# Altium schematic sheet 33.SchDoc
size A2
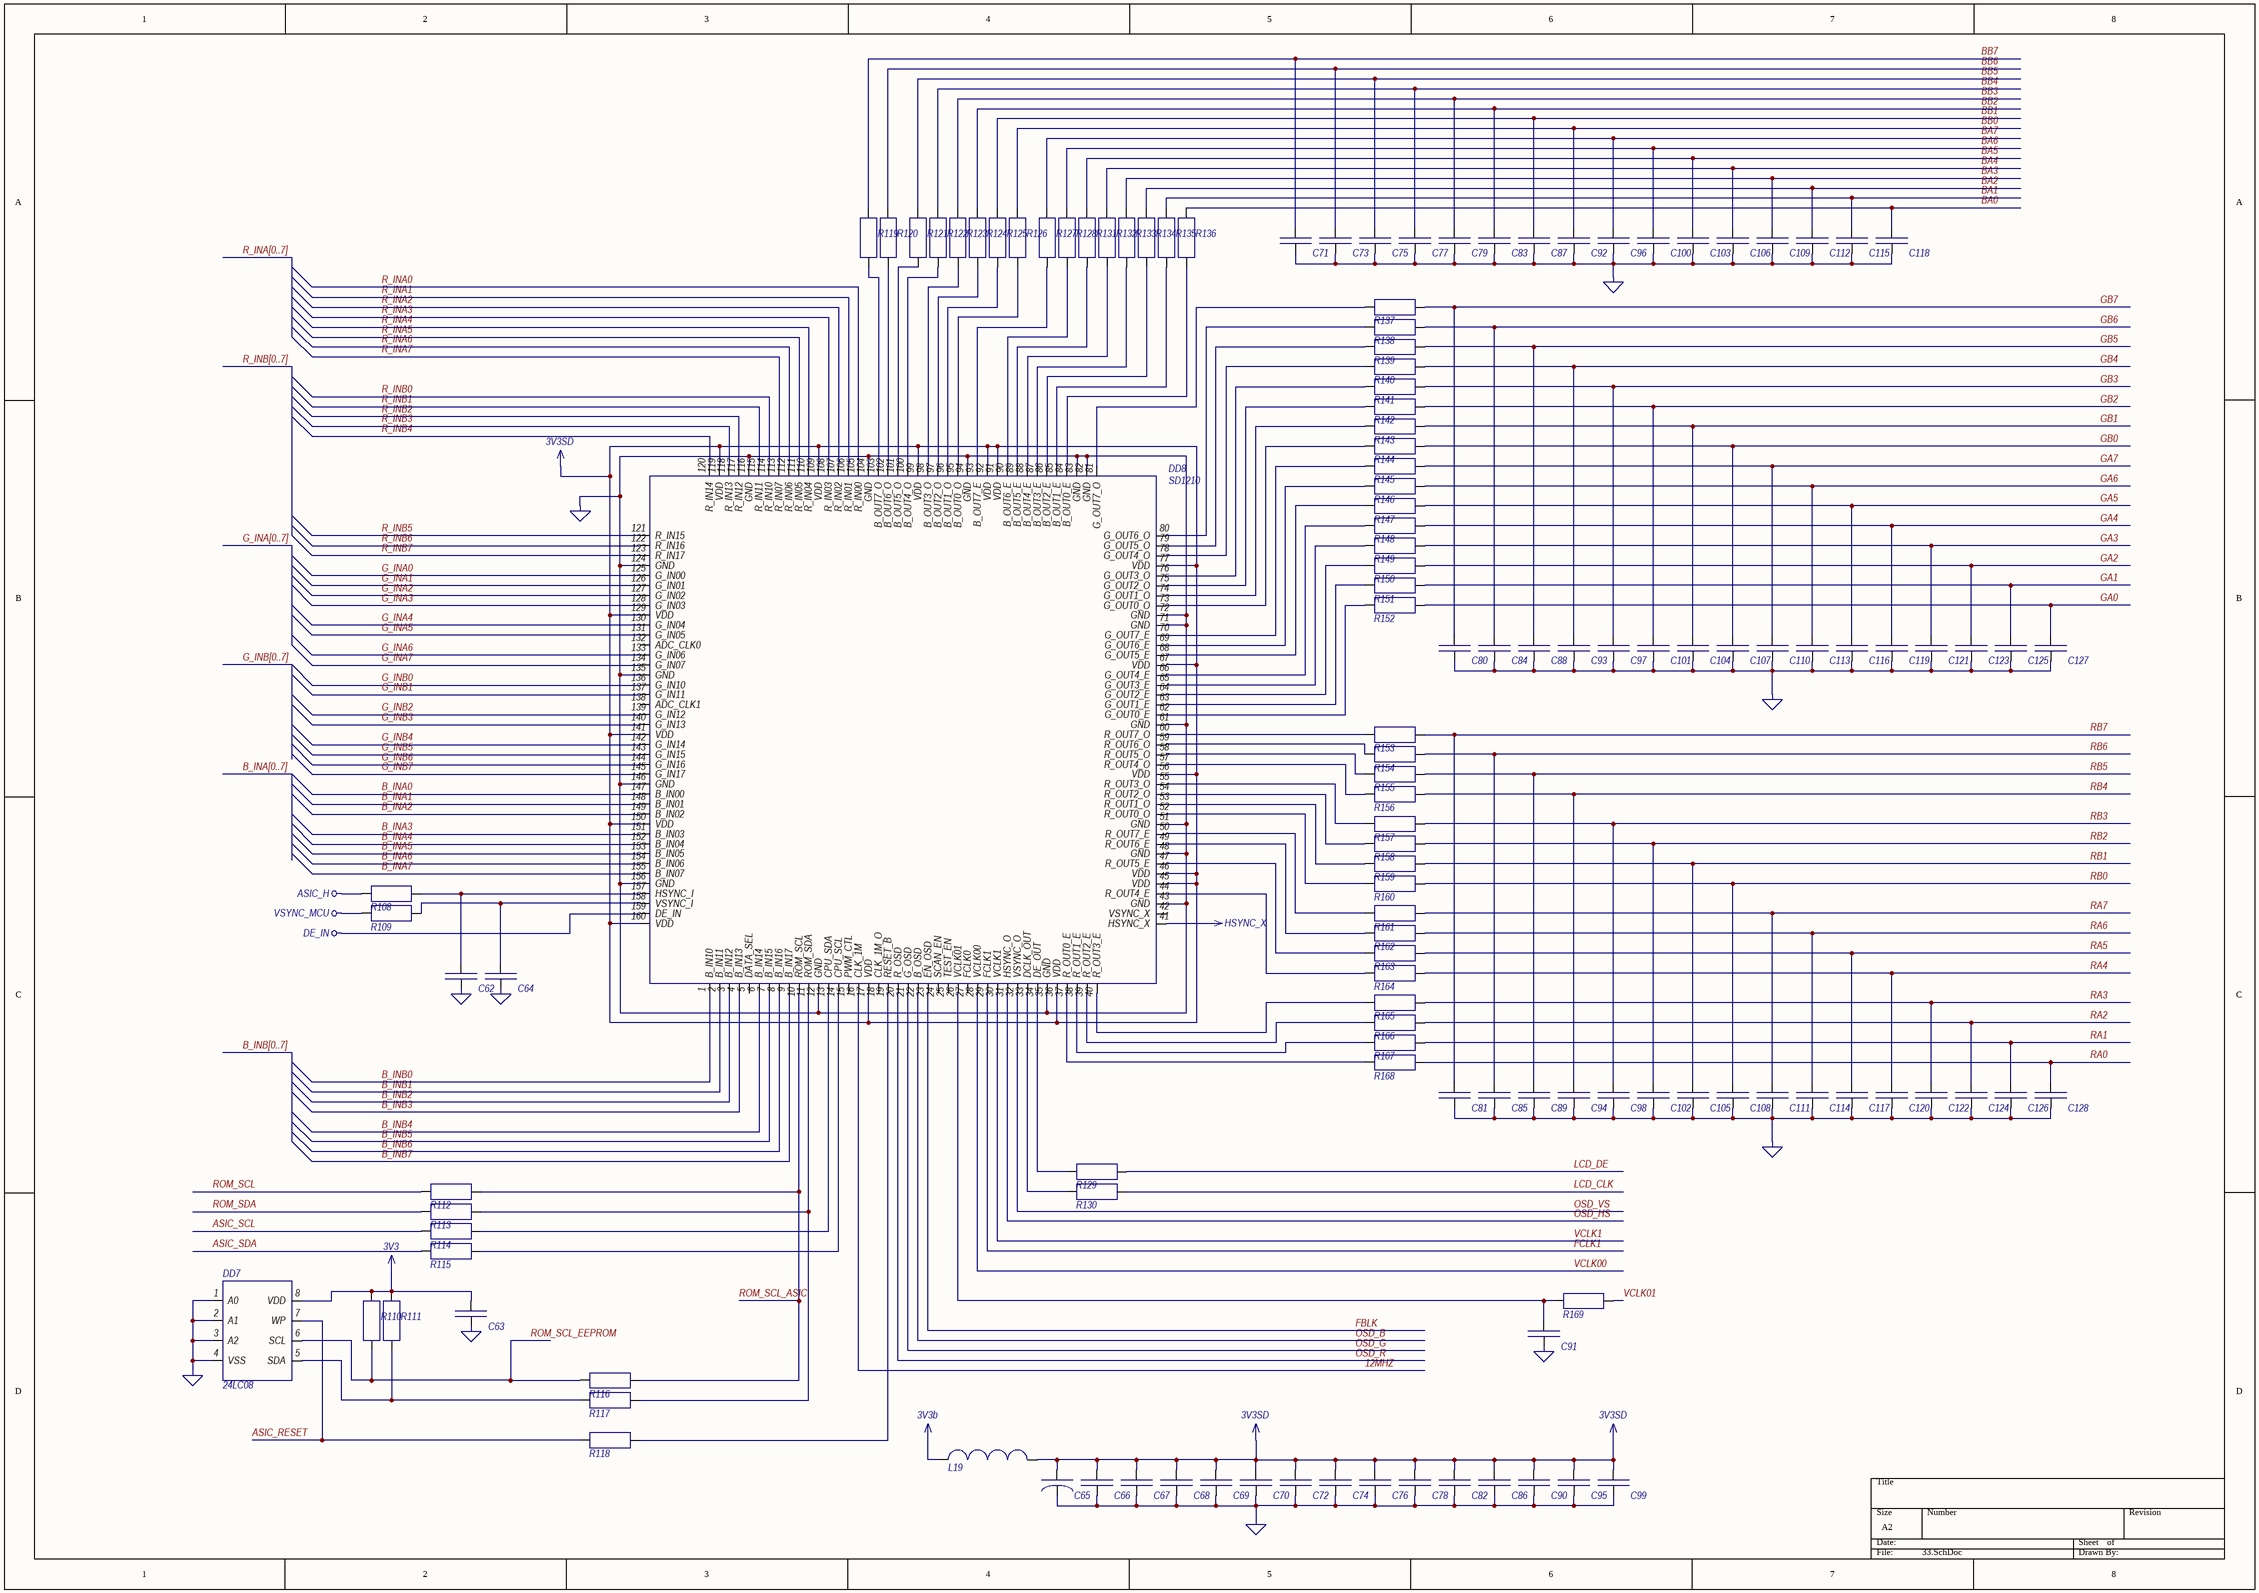
[diagram p0: 33.SchDoc]

## Parts
C62  Capacitor  [cap_electro_13]  (value not drawn)
C63  Capacitor  [cap_electro_13]  (value not drawn)
C64  Capacitor  [cap_electro_13]  (value not drawn)
C65  TuningCapacitor  [Cap_tantal_D]  (value not drawn)
C66  Capacitor  [cap_electro_13]  (value not drawn)
C67  Capacitor  [cap_electro_13]  (value not drawn)
C68  Capacitor  [cap_electro_13]  (value not drawn)
C69  Capacitor  [cap_electro_13]  (value not drawn)
C70  Capacitor  [cap_electro_13]  (value not drawn)
C71  Capacitor  [cap_electro_13]  (value not drawn)
C72  Capacitor  [cap_electro_13]  (value not drawn)
C73  Capacitor  [cap_electro_13]  (value not drawn)
C74  Capacitor  [cap_electro_13]  (value not drawn)
C75  Capacitor  [cap_electro_13]  (value not drawn)
C76  Capacitor  [cap_electro_13]  (value not drawn)
C77  Capacitor  [cap_electro_13]  (value not drawn)
C78  Capacitor  [cap_electro_13]  (value not drawn)
C79  Capacitor  [cap_electro_13]  (value not drawn)
C80  Capacitor  [cap_electro_13]  (value not drawn)
C81  Capacitor  [cap_electro_13]  (value not drawn)
C82  Capacitor  [cap_electro_13]  (value not drawn)
C83  Capacitor  [cap_electro_13]  (value not drawn)
C84  Capacitor  [cap_electro_13]  (value not drawn)
C85  Capacitor  [cap_electro_13]  (value not drawn)
C86  Capacitor  [cap_electro_13]  (value not drawn)
C87  Capacitor  [cap_electro_13]  (value not drawn)
C88  Capacitor  [cap_electro_13]  (value not drawn)
C89  Capacitor  [cap_electro_13]  (value not drawn)
C90  Capacitor  [cap_electro_13]  (value not drawn)
C91  Capacitor  [cap_electro_13]  (value not drawn)
C92  Capacitor  [cap_electro_13]  (value not drawn)
C93  Capacitor  [cap_electro_13]  (value not drawn)
C94  Capacitor  [cap_electro_13]  (value not drawn)
C95  Capacitor  [cap_electro_13]  (value not drawn)
C96  Capacitor  [cap_electro_13]  (value not drawn)
C97  Capacitor  [cap_electro_13]  (value not drawn)
C98  Capacitor  [cap_electro_13]  (value not drawn)
C99  Capacitor  [cap_electro_13]  (value not drawn)
C100  Capacitor  [cap_electro_13]  (value not drawn)
C101  Capacitor  [cap_electro_13]  (value not drawn)
C102  Capacitor  [cap_electro_13]  (value not drawn)
C103  Capacitor  [cap_electro_13]  (value not drawn)
C104  Capacitor  [cap_electro_13]  (value not drawn)
C105  Capacitor  [cap_electro_13]  (value not drawn)
C106  Capacitor  [cap_electro_13]  (value not drawn)
C107  Capacitor  [cap_electro_13]  (value not drawn)
C108  Capacitor  [cap_electro_13]  (value not drawn)
C109  Capacitor  [cap_electro_13]  (value not drawn)
C110  Capacitor  [cap_electro_13]  (value not drawn)
C111  Capacitor  [cap_electro_13]  (value not drawn)
C112  Capacitor  [cap_electro_13]  (value not drawn)
C113  Capacitor  [cap_electro_13]  (value not drawn)
C114  Capacitor  [cap_electro_13]  (value not drawn)
C115  Capacitor  [cap_electro_13]  (value not drawn)
C116  Capacitor  [cap_electro_13]  (value not drawn)
C117  Capacitor  [cap_electro_13]  (value not drawn)
C118  Capacitor  [cap_electro_13]  (value not drawn)
C119  Capacitor  [cap_electro_13]  (value not drawn)
C120  Capacitor  [cap_electro_13]  (value not drawn)
C121  Capacitor  [cap_electro_13]  (value not drawn)
C122  Capacitor  [cap_electro_13]  (value not drawn)
C123  Capacitor  [cap_electro_13]  (value not drawn)
C124  Capacitor  [cap_electro_13]  (value not drawn)
C125  Capacitor  [cap_electro_13]  (value not drawn)
C126  Capacitor  [cap_electro_13]  (value not drawn)
C127  Capacitor  [cap_electro_13]  (value not drawn)
C128  Capacitor  [cap_electro_13]  (value not drawn)
DD7  24LC08  [24Cxx]
DD8  SD1210  [SD1210]
L19  Inductor  [inductor]  (value not drawn)
R108  Resistor  [R_1206]  (value not drawn)
R109  Resistor  [R_1206]  (value not drawn)
R110  Resistor  [R_1206]  (value not drawn)
R111  Resistor  [R_1206]  (value not drawn)
R112  Resistor  [R_1206]  (value not drawn)
R113  Resistor  [R_1206]  (value not drawn)
R114  Resistor  [R_1206]  (value not drawn)
R115  Resistor  [R_1206]  (value not drawn)
R116  Resistor  [R_1206]  (value not drawn)
R117  Resistor  [R_1206]  (value not drawn)
R118  Resistor  [R_1206]  (value not drawn)
R119  Resistor  [R_1206]  (value not drawn)
R120  Resistor  [R_1206]  (value not drawn)
R121  Resistor  [R_1206]  (value not drawn)
R122  Resistor  [R_1206]  (value not drawn)
R123  Resistor  [R_1206]  (value not drawn)
R124  Resistor  [R_1206]  (value not drawn)
R125  Resistor  [R_1206]  (value not drawn)
R126  Resistor  [R_1206]  (value not drawn)
R127  Resistor  [R_1206]  (value not drawn)
R128  Resistor  [R_1206]  (value not drawn)
R129  Resistor  [R_1206]  (value not drawn)
R130  Resistor  [R_1206]  (value not drawn)
R131  Resistor  [R_1206]  (value not drawn)
R132  Resistor  [R_1206]  (value not drawn)
R133  Resistor  [R_1206]  (value not drawn)
R134  Resistor  [R_1206]  (value not drawn)
R135  Resistor  [R_1206]  (value not drawn)
R136  Resistor  [R_1206]  (value not drawn)
R137  Resistor  [R_1206]  (value not drawn)
R138  Resistor  [R_1206]  (value not drawn)
R139  Resistor  [R_1206]  (value not drawn)
R140  Resistor  [R_1206]  (value not drawn)
R141  Resistor  [R_1206]  (value not drawn)
R142  Resistor  [R_1206]  (value not drawn)
R143  Resistor  [R_1206]  (value not drawn)
R144  Resistor  [R_1206]  (value not drawn)
R145  Resistor  [R_1206]  (value not drawn)
R146  Resistor  [R_1206]  (value not drawn)
R147  Resistor  [R_1206]  (value not drawn)
R148  Resistor  [R_1206]  (value not drawn)
R149  Resistor  [R_1206]  (value not drawn)
R150  Resistor  [R_1206]  (value not drawn)
R151  Resistor  [R_1206]  (value not drawn)
R152  Resistor  [R_1206]  (value not drawn)
R153  Resistor  [R_1206]  (value not drawn)
R154  Resistor  [R_1206]  (value not drawn)
R155  Resistor  [R_1206]  (value not drawn)
R156  Resistor  [R_1206]  (value not drawn)
R157  Resistor  [R_1206]  (value not drawn)
R158  Resistor  [R_1206]  (value not drawn)
R159  Resistor  [R_1206]  (value not drawn)
R160  Resistor  [R_1206]  (value not drawn)
R161  Resistor  [R_1206]  (value not drawn)
R162  Resistor  [R_1206]  (value not drawn)
R163  Resistor  [R_1206]  (value not drawn)
R164  Resistor  [R_1206]  (value not drawn)
R165  Resistor  [R_1206]  (value not drawn)
R166  Resistor  [R_1206]  (value not drawn)
R167  Resistor  [R_1206]  (value not drawn)
R168  Resistor  [R_1206]  (value not drawn)
R169  Resistor  [R_1206]  (value not drawn)

## Nets
3V3: C63.2 DD7.8(VDD) R110.1 R111.1
3V3b: L19.1
3V3SD: C65.1 C66.2 C67.2 C68.2 C69.2 C70.2 C72.2 C74.2 C76.2 C78.2 C82.2 C86.2 C90.2 C95.2 C99.2 DD8.17(VDD) DD8.36(VDD) DD8.45(VDD) DD8.46(VDD) DD8.56(VDD) DD8.67(VDD) DD8.77(VDD) DD8.91(VDD) DD8.92(VDD) DD8.99(VDD) DD8.109(VDD) DD8.119(VDD) DD8.129(VDD) DD8.141(VDD) DD8.150(VDD) DD8.160(VDD) L19.2
ASIC_H: R108.2
DE_IN: DD8.159(DE_IN)
GND: C62.1 C63.1 C64.1 C65.2 C66.1 C67.1 C68.1 C69.1 C70.1 C71.1 C72.1 C73.1 C74.1 C75.1 C76.1 C77.1 C78.1 C79.1 C80.1 C81.1 C82.1 C83.1 C84.1 C85.1 C86.1 C87.1 C88.1 C89.1 C90.1 C91.1 C92.1 C93.1 C94.1 C95.1 C96.1 C97.1 C98.1 C99.1 C100.1 C101.1 C102.1 C103.1 C104.1 C105.1 C106.1 C107.1 C108.1 C109.1 C110.1 C111.1 C112.1 C113.1 C114.1 C115.1 C116.1 C117.1 C118.1 C119.1 C120.1 C121.1 C122.1 C123.1 C124.1 C125.1 C126.1 C127.1 C128.1 DD7.1(A0) DD7.2(A1) DD7.3(A2) DD7.4(VSS) DD8.12(GND) DD8.35(GND) DD8.43(GND) DD8.48(GND) DD8.51(GND) DD8.61(GND) DD8.71(GND) DD8.72(GND) DD8.82(GND) DD8.83(GND) DD8.94(GND) DD8.104(GND) DD8.116(GND) DD8.124(GND) DD8.135(GND) DD8.146(GND) DD8.156(GND)
HSYNC_X: DD8.41(HSYNC_X)
VSYNC_MCU: R109.2
12MHZ: DD8.16(CLK_1M)
ASIC_RESET: DD7.7(WP) R118.2
ASIC_SCL: R114.2
ASIC_SDA: R115.2
B_INA0: DD8.147(B_IN00)
B_INA1: DD8.148(B_IN01)
B_INA2: DD8.149(B_IN02)
B_INA3: DD8.151(B_IN03)
B_INA4: DD8.152(B_IN04)
B_INA5: DD8.153(B_IN05)
B_INA6: DD8.154(B_IN06)
B_INA7: DD8.155(B_IN07)
B_INB0: DD8.1(B_IN10)
B_INB1: DD8.2(B_IN11)
B_INB2: DD8.3(B_IN12)
B_INB3: DD8.4(B_IN13)
B_INB4: DD8.6(B_IN14)
B_INB5: DD8.7(B_IN15)
B_INB6: DD8.8(B_IN16)
B_INB7: DD8.9(B_IN17)
BA0: C118.2 R136.1
BA1: C115.2 R135.1
BA2: C112.2 R134.1
BA3: C109.2 R133.1
BA4: C106.2 R132.1
BA5: C103.2 R131.1
BA6: C100.2 R128.1
BA7: C96.2 R127.1
BB0: C92.2 R126.1
BB1: C87.2 R125.1
BB2: C83.2 R124.1
BB3: C79.2 R123.1
BB4: C77.2 R122.1
BB5: C75.2 R121.1
BB6: C73.2 R120.1
BB7: C71.2 R119.1
FBLK: DD8.23(EN_OSD)
FCLK1: DD8.29(FCLK1)
G_INA0: DD8.125(G_IN00)
G_INA1: DD8.126(G_IN01)
G_INA2: DD8.127(G_IN02)
G_INA3: DD8.128(G_IN03)
G_INA4: DD8.130(G_IN04)
G_INA5: DD8.131(G_IN05)
G_INA6: DD8.133(G_IN06)
G_INA7: DD8.134(G_IN07)
G_INB0: DD8.136(G_IN10)
G_INB1: DD8.137(G_IN11)
G_INB2: DD8.139(G_IN12)
G_INB3: DD8.140(G_IN13)
G_INB4: DD8.142(G_IN14)
G_INB5: DD8.143(G_IN15)
G_INB6: DD8.144(G_IN16)
G_INB7: DD8.145(G_IN17)
GA0: C127.2 R152.1
GA1: C125.2 R151.1
GA2: C123.2 R150.1
GA3: C121.2 R149.1
GA4: C119.2 R148.1
GA5: C116.2 R147.1
GA6: C113.2 R146.1
GA7: C110.2 R145.1
GB0: C107.2 R144.1
GB1: C104.2 R143.1
GB2: C101.2 R142.1
GB3: C97.2 R141.1
GB4: C93.2 R140.1
GB5: C88.2 R139.1
GB6: C84.2 R138.1
GB7: C80.2 R137.1
LCD_CLK: R130.1
LCD_DE: R129.1
OSD_B: DD8.22(B_OSD)
OSD_G: DD8.21(G_OSD)
OSD_HS: DD8.31(HSYNC_O)
OSD_R: DD8.20(R_OSD)
OSD_VS: DD8.32(VSYNC_O)
R_INA0: DD8.105(R_IN00)
R_INA1: DD8.106(R_IN01)
R_INA2: DD8.107(R_IN02)
R_INA3: DD8.108(R_IN03)
R_INA4: DD8.110(R_IN04)
R_INA5: DD8.111(R_IN05)
R_INA6: DD8.112(R_IN06)
R_INA7: DD8.113(R_IN07)
R_INB0: DD8.114(R_IN10)
R_INB1: DD8.115(R_IN11)
R_INB2: DD8.117(R_IN12)
R_INB3: DD8.118(R_IN13)
R_INB4: DD8.120(R_IN14)
R_INB5: DD8.121(R_IN15)
R_INB6: DD8.122(R_IN16)
R_INB7: DD8.123(R_IN17)
RA0: C128.2 R168.1
RA1: C126.2 R167.1
RA2: C124.2 R166.1
RA3: C122.2 R165.1
RA4: C120.2 R164.1
RA5: C117.2 R163.1
RA6: C114.2 R162.1
RA7: C111.2 R161.1
RB0: C108.2 R160.1
RB1: C105.2 R159.1
RB2: C102.2 R158.1
RB3: C98.2 R157.1
RB4: C94.2 R156.1
RB5: C89.2 R155.1
RB6: C85.2 R154.1
RB7: C81.2 R153.1
ROM_SCL: R112.2
ROM_SCL_ASIC: DD8.10(ROM_SCL) R112.1 R116.1
ROM_SCL_EEPROM: DD7.6(SCL) R110.2 R116.2
ROM_SDA: R113.2
VCLK00: DD8.28(VCLK00)
VCLK01: R169.1
VCLK1: DD8.30(VCLK1)
NetC62_2: C62.2 DD8.157(HSYNC_I) R108.1
NetC64_2: C64.2 DD8.158(VSYNC_I) R109.1
NetC91_2: C91.2 DD8.26(VCLK01) R169.2
NetDD7_5: DD7.5(SDA) R111.2 R117.2
NetDD8_11: DD8.11(ROM_SDA) R113.1 R117.1
NetDD8_13: DD8.13(CPU_SDA) R114.1
NetDD8_14: DD8.14(CPU_SCL) R115.1
NetDD8_19: DD8.19(RESET_B) R118.1
NetDD8_33: DD8.33(DCLK_OUT) R130.2
NetDD8_34: DD8.34(DE_OUT) R129.2
NetDD8_37: DD8.37(R_OUT0_E) R168.2
NetDD8_38: DD8.38(R_OUT1_E) R167.2
NetDD8_39: DD8.39(R_OUT2_E) R166.2
NetDD8_40: DD8.40(R_OUT3_E) R165.2
NetDD8_44: DD8.44(R_OUT4_E) R164.2
NetDD8_47: DD8.47(R_OUT5_E) R163.2
NetDD8_49: DD8.49(R_OUT6_E) R162.2
NetDD8_50: DD8.50(R_OUT7_E) R161.2
NetDD8_52: DD8.52(R_OUT0_O) R160.2
NetDD8_53: DD8.53(R_OUT1_O) R159.2
NetDD8_54: DD8.54(R_OUT2_O) R158.2
NetDD8_55: DD8.55(R_OUT3_O) R157.2
NetDD8_57: DD8.57(R_OUT4_O) R156.2
NetDD8_58: DD8.58(R_OUT5_O) R155.2
NetDD8_59: DD8.59(R_OUT6_O) R154.2
NetDD8_60: DD8.60(R_OUT7_O) R153.2
NetDD8_62: DD8.62(G_OUT0_E) R152.2
NetDD8_63: DD8.63(G_OUT1_E) R151.2
NetDD8_64: DD8.64(G_OUT2_E) R150.2
NetDD8_65: DD8.65(G_OUT3_E) R149.2
NetDD8_66: DD8.66(G_OUT4_E) R148.2
NetDD8_68: DD8.68(G_OUT5_E) R147.2
NetDD8_69: DD8.69(G_OUT6_E) R146.2
NetDD8_70: DD8.70(G_OUT7_E) R145.2
NetDD8_73: DD8.73(G_OUT0_O) R144.2
NetDD8_74: DD8.74(G_OUT1_O) R143.2
NetDD8_75: DD8.75(G_OUT2_O) R142.2
NetDD8_76: DD8.76(G_OUT3_O) R141.2
NetDD8_78: DD8.78(G_OUT4_O) R140.2
NetDD8_79: DD8.79(G_OUT5_O) R139.2
NetDD8_80: DD8.80(G_OUT6_O) R138.2
NetDD8_81: DD8.81(G_OUT7_O) R137.2
NetDD8_84: DD8.84(B_OUT0_E) R136.2
NetDD8_85: DD8.85(B_OUT1_E) R135.2
NetDD8_86: DD8.86(B_OUT2_E) R134.2
NetDD8_87: DD8.87(B_OUT3_E) R133.2
NetDD8_88: DD8.88(B_OUT4_E) R132.2
NetDD8_89: DD8.89(B_OUT5_E) R131.2
NetDD8_90: DD8.90(B_OUT6_E) R128.2
NetDD8_93: DD8.93(B_OUT7_E) R127.2
NetDD8_95: DD8.95(B_OUT0_O) R126.2
NetDD8_96: DD8.96(B_OUT1_O) R125.2
NetDD8_97: DD8.97(B_OUT2_O) R124.2
NetDD8_98: DD8.98(B_OUT3_O) R123.2
NetDD8_100: DD8.100(B_OUT4_O) R122.2
NetDD8_101: DD8.101(B_OUT5_O) R121.2
NetDD8_102: DD8.102(B_OUT6_O) R120.2
NetDD8_103: DD8.103(B_OUT7_O) R119.2

Not connected (* = marked no-connect by the designer): DD8 5(DATA_SEL) 15(PWM_CTL) 18(CLK_1M_O) 24(SCAN_EN) 25(TEST_EN) 27(FCLK0) 42(VSYNC_X) 132(ADC_CLK0) 138(ADC_CLK1)

## Buses and harness runs
bus B_INA[0..7]
bus B_INB[0..7]
bus G_INA[0..7]
bus G_INB[0..7]
bus R_INA[0..7]
bus R_INB[0..7]